# EAGLE design miniprotogrove (EAGLE 5.11)
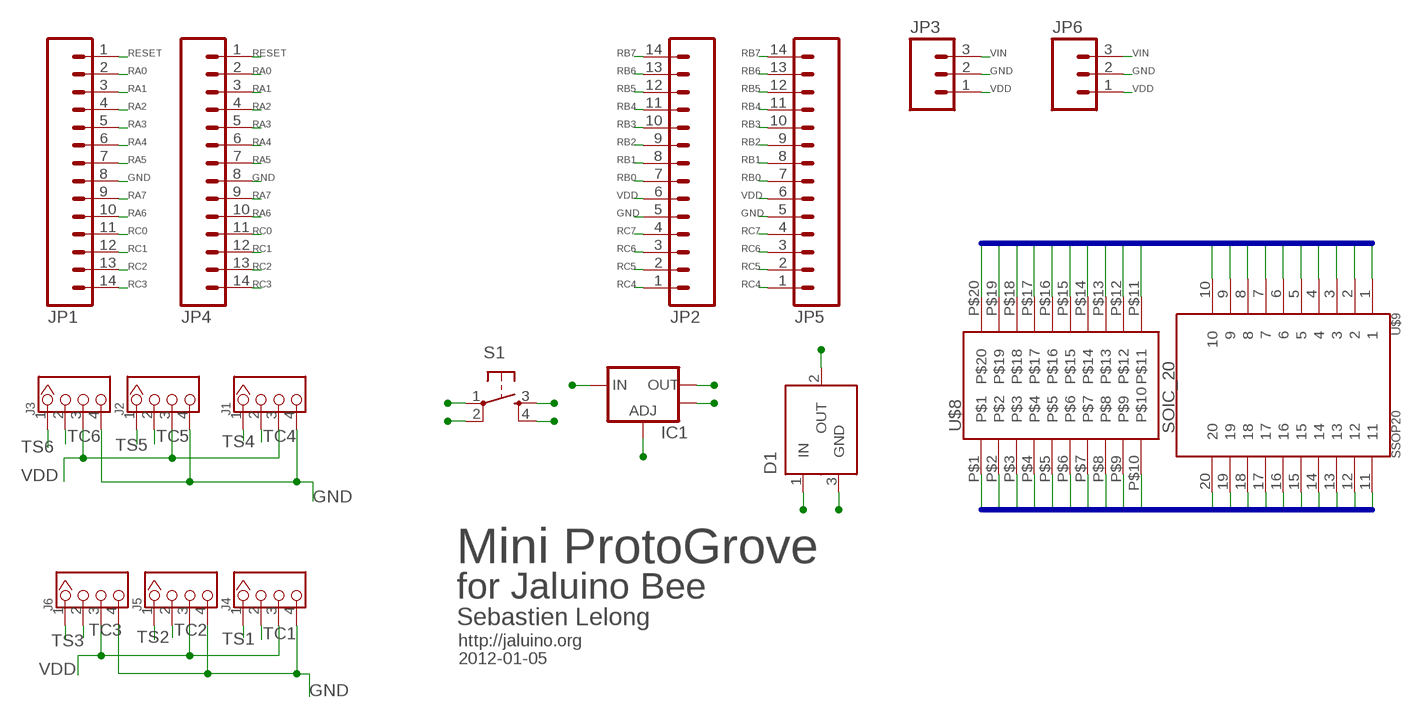
[diagram p0: schematic, sheet 1]

## Parts
D1  MAX6520  [SOT23]
IC1  V_REG_LM1117SOT223  [SOT223]
J1  TWIG-4P-2.0-2.0  [4P-2.0]
J2  TWIG-4P-2.0-2.0  [4P-2.0]
J3  TWIG-4P-2.0-2.0  [4P-2.0]
J4  TWIG-4P-2.0'90D'  [4P-2.0-90D]
J5  TWIG-4P-2.0'90D'  [4P-2.0-90D]
J6  TWIG-4P-2.0'90D'  [4P-2.0-90D]
JP1  M14  [1X14]
JP2  M14  [1X14]
JP3  M03PTH  [1X03]
JP4  M14  [1X14]
JP5  M14  [1X14]
JP6  M03PTH  [1X03]
S1  TAC_SWITCHSMD  [TACTILE_SWITCH_SMD]
U$8  SOIC_20  [SO20W]
U$9  SSOP20  [SSOP20-LONG]

## Nets
B1: U$8.P$11 U$9.10
B2: U$8.P$12 U$9.9
B3: U$8.P$13 U$9.8
B4: U$8.P$14 U$9.7
B5: U$8.P$15 U$9.6
B6: U$8.P$16 U$9.5
B7: U$8.P$17 U$9.4
B8: U$8.P$18 U$9.3
B9: U$8.P$19 U$9.2
B10: U$8.P$20 U$9.1
C1: U$8.P$1 U$9.20
C2: U$8.P$2 U$9.19
C3: U$8.P$3 U$9.18
C4: U$8.P$4 U$9.17
C5: U$8.P$5 U$9.16
C6: U$8.P$6 U$9.15
C7: U$8.P$7 U$9.14
C8: U$8.P$8 U$9.13
C9: U$8.P$9 U$9.12
C10: U$8.P$10 U$9.11
GND: J1.4 J2.4 J3.4 J4.4 J5.4 J6.4 JP1.8 JP2.5 JP3.2 JP4.8 JP5.5 JP6.2
N$188: IC1.3(IN)
N$191: IC1.1(ADJ)
N$192: IC1.2(OUT)
N$194: IC1.4(OUT)
N$197: D1.1(IN)
N$198: D1.3(GND)
N$199: D1.2(OUT)
N$200: S1.1
N$201: S1.2
N$202: S1.3
N$203: S1.4
RA0: JP1.2 JP4.2
RA1: JP1.3 JP4.3
RA2: JP1.4 JP4.4
RA3: JP1.5 JP4.5
RA4: JP1.6 JP4.6
RA5: JP1.7 JP4.7
RA6: JP1.10 JP4.10
RA7: JP1.9 JP4.9
RB0: JP2.7 JP5.7
RB1: JP2.8 JP5.8
RB2: JP2.9 JP5.9
RB3: JP2.10 JP5.10
RB4: JP2.11 JP5.11
RB5: JP2.12 JP5.12
RB6: JP2.13 JP5.13
RB7: JP2.14 JP5.14
RC0: JP1.11 JP4.11
RC1: JP1.12 JP4.12
RC2: JP1.13 JP4.13
RC3: JP1.14 JP4.14
RC4: JP2.1 JP5.1
RC5: JP2.2 JP5.2
RC6: JP2.3 JP5.3
RC7: JP2.4 JP5.4
RESET: JP1.1 JP4.1
TC1: J4.2
TC2: J5.2
TC3: J6.2
TC4: J1.2
TC5: J2.2
TC6: J3.2
TS1: J4.1
TS2: J5.1
TS3: J6.1
TS4: J1.1
TS5: J2.1
TS6: J3.1
VDD: J1.3 J2.3 J3.3 J4.3 J5.3 J6.3 JP2.6 JP3.1 JP5.6 JP6.1
VIN: JP3.3 JP6.3

## Buses
B[1..10]
C[1..10]

## Notes on the sheet
- Mini ProtoGrove
- for Jaluino Bee
- Sebastien Lelong
- http://jaluino.org
- 2012-01-05

## Library data of the parts
D1 = maxim:MAX6520: 1.2V Voltage Reference 50ppm/°C, SOT23, 3-Terminal Source: http://datasheets.maxim-ic.com/en/ds/MAX6520.pdf; MF: MAXIM; MPN: MAX6520EUR-T; OC_FARNELL: unknown; OC_NEWARK: 02J4586
IC1 = SparkFun:V_REG_LM1117: Voltage Regulator LM1117 Standard adjustable voltage regulator but in SMD form. Spark Fun Electronics SKU : COM-00595
J1-J6 = Connector:TWIG-4P-2.0
JP1 JP2 JP4 JP5 = SparkFun:M14: Header 14 Standard 14-pin 0.1" header. Use with straight break away headers (SKU : PRT-00116), right angle break away headers (PRT-00553), swiss pins (PRT-00743), machine pins (PRT-00117), and female headers (PRT-00115).
JP3 JP6 = SparkFun:M03: Header 3 Standard 3-pin 0.1" header. Use with straight break away headers (SKU : PRT-00116), right angle break away headers (PRT-00553), swiss pins (PRT-00743), machine pins (PRT-00117), and female headers (PRT-00115). Molex polarized connector foot print use with SKU : PRT-08232 with associated crimp pins and housings.
S1 = SparkFun:TAC_SWITCH: Momentary Switch Button commonly used for reset or general input. Spark Fun Electronics SKU : COM-00097
U$8 = SparkFun:SOIC_20
U$9 = SparkFun:SSOP20

## Board
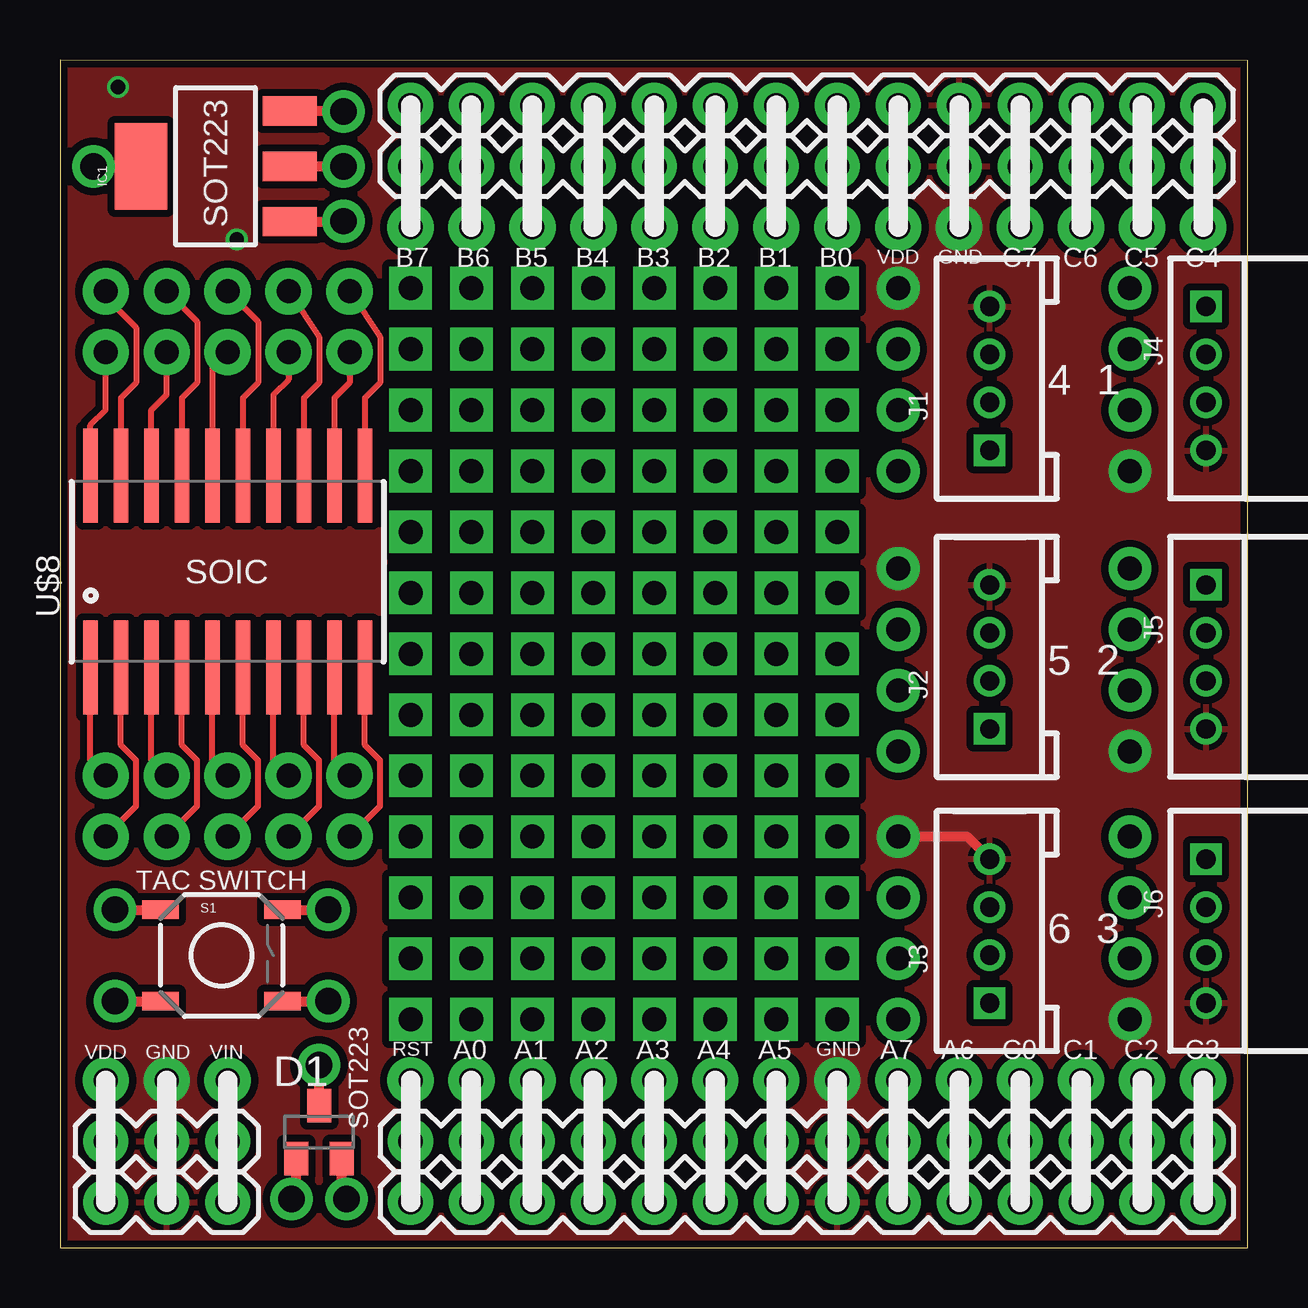
[diagram p1: board, top side]
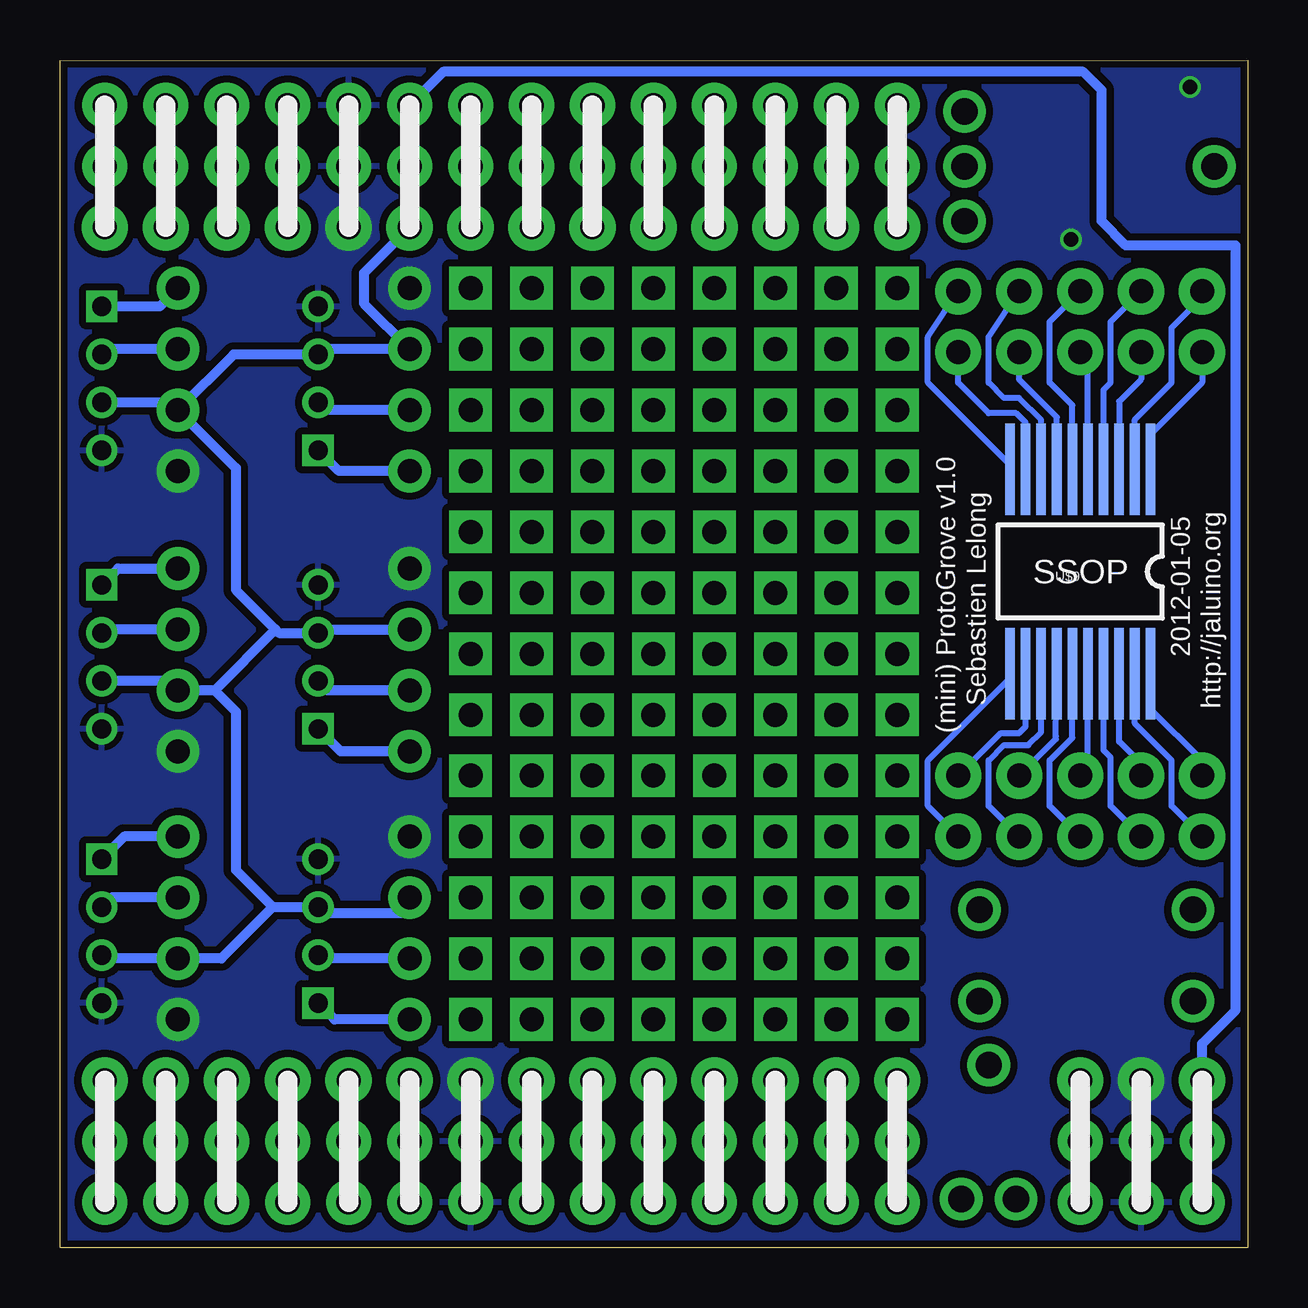
[diagram p2: board, bottom side, seen from below]

Size 49.49 x 49.52 mm. Coordinates in mm from the lower left corner, seen from the top.
Outline: 0,0 49.49,0 49.49,49.49 0,49.52 0,0
Copper layers (1*16): Top 0.035mm / dielectric 1.5mm / Bottom 0.035mm
Design rules "protogrove_seeed": minimum track width 6mil, minimum drill 12mil, track to track 6mil, track to pad 6mil, pad to pad 6mil, via to via 6mil, smd to smd 0mil, copper to edge 10mil, drill to drill 10mil, minimum pad ring 10mil, minimum via ring 6mil, stop-mask expansion 2mil, vias tented up to drill 100mil, thermal gap 10mil

### Footprints (pad centres in the part's own frame; a part is rotated, then mirrored left to right if it is on the bottom)
SOT23 = smd 1 x 1.4: 1 -0.95,-1.1; 2 0.95,-1.1; 3 0,1.1
SOT223 = smd 1.219 x 2.235: 1 -2.311,-3.099; 2 0,-3.099; 3 2.311,-3.099 | smd 3.6 x 2.2: 4 0,3.099
4P-2.0 = drill 0.8 pad 1.27 square: 1 -3,0 | drill 0.8 pad 1.27 round: 2 -1,0; 3 1,0; 4 3,0
4P-2.0-90D = drill 0.8 pad 1.27 square: 1 -3,0 | drill 0.8 pad 1.27 round: 2 -1,0; 3 1,0; 4 3,0
1X14 = drill 1.016 pad 1.88 round: 1 0,0; 2 2.54,0; 3 5.08,0; 4 7.62,0; 5 10.16,0; 6 12.7,0; 7 15.24,0; 8 17.78,0; 9 20.32,0; 10 22.86,0; 11 25.4,0; 12 27.94,0; 13 30.48,0; 14 33.02,0
1X03 = drill 1.016 pad 1.88 round: 1 0,0; 2 2.54,0; 3 5.08,0
TACTILE_SWITCH_SMD = smd 1.524 x 0.762: 1 -2.54,1.905; 2 2.54,1.905; 3 -2.54,-1.905; 4 2.54,-1.905
SO20W = smd 0.6 x 3.9: P$1 -5.715,-4; P$2 -4.445,-4; P$3 -3.175,-4; P$4 -1.905,-4; P$5 -0.635,-4; P$6 0.635,-4; P$7 1.905,-4; P$8 3.175,-4; P$9 4.445,-4; P$10 5.715,-4; P$11 5.715,4; P$12 4.445,4; P$13 3.175,4; P$14 1.905,4; P$15 0.635,4; P$16 -0.635,4; P$17 -1.905,4; P$18 -3.175,4; P$19 -4.445,4; P$20 -5.715,4
SSOP20-LONG = smd 0.4 x 3.81: 1 -2.925,-4.26; 2 -2.275,-4.26; 3 -1.625,-4.26; 4 -0.975,-4.26; 5 -0.325,-4.26; 6 0.325,-4.26; 7 0.975,-4.26; 8 1.625,-4.26; 9 2.275,-4.26; 10 2.925,-4.26; 11 2.925,4.26; 12 2.275,4.26; 13 1.625,4.26; 14 0.975,4.26; 15 0.325,4.26; 16 -0.325,4.26; 17 -0.975,4.26; 18 -1.625,4.26; 19 -2.275,4.26; 20 -2.925,4.26

### Placement (x,y rotation side)
D1  10.79,4.83 0 top
IC1  6.48,45.09 90 top
J1  38.73,36.25 90 top
J2  38.73,24.64 90 top
J3  38.73,13.21 90 top
J4  47.75,36.25 270 top
J5  47.75,24.64 270 top
J6  47.75,13.21 270 top
JP1  14.61,1.91 0 top
JP2  47.62,45.09 180 top
JP3  1.91,1.91 0 top
JP4  14.61,4.45 0 top
JP5  47.62,47.62 180 top
JP6  1.91,4.45 0 top
S1  6.73,12.19 0 top
U$8  6.99,28.19 0 top
U$9  6.99,28.19 180 bottom

### Tracks (layer width: path | path; a pad name or v marks a point on that pad's centre or on a via)
B1  (via drill 1 pad 1.93)
  Top 0.254: U$8.P$11 12.7,35.43 13.34,36.07 13.34,37.97 v12.06,39.88
  Bottom 0.254: U$9.10 9.91,32.64 13.34,36.07 13.34,37.97 v12.06,39.88
B2  (via drill 1 pad 1.93)
  Top 0.254: U$8.P$12 11.43,35.43 12.06,36.07 v12.06,37.34
  Bottom 0.254: U$9.9 9.26,34.41 9.65,34.8 10.79,34.8 12.06,36.07 v12.06,37.34
B3  (via drill 1 pad 1.93)
  Top 0.254: U$8.P$13 10.16,35.43 10.79,36.07 10.79,37.97 v9.53,39.88
  Bottom 0.254: U$9.8 8.61,34.52 9.53,35.43 10.16,35.43 10.79,36.07 10.79,37.97 v9.53,39.88
B4  (via drill 1 pad 1.93)
  Top 0.254: U$8.P$14 8.89,35.56 9.53,36.2 v9.53,37.34
  Bottom 0.254: U$9.7 7.96,34.63 9.53,36.2 v9.53,37.34
B5  (via drill 1 pad 1.93)
  Top 0.254: U$8.P$15 7.62,35.43 8.26,36.07 8.26,38.61 v6.99,39.88
  Bottom 0.254: U$9.6 7.31,35.12 8.26,36.07 8.26,38.61 v6.99,39.88
B6  (via drill 1 pad 1.93)
  Top 0.254: U$8.P$16 6.35,36.7 v6.99,37.34
  Bottom 0.254: U$9.5 6.66,37.01 v6.99,37.34
B7  (via drill 1 pad 1.93)
  Top 0.254: U$8.P$17 5.08,35.43 5.71,36.07 5.71,38.61 v4.45,39.88
  Bottom 0.254: U$9.4 6.01,35.77 5.71,36.07 5.71,38.61 v4.45,39.88
B8  (via drill 1 pad 1.93)
  Top 0.254: U$8.P$18 3.81,34.92 4.45,35.56 v4.45,37.34
  Bottom 0.254: U$9.3 5.36,35.28 4.45,36.2 v4.45,37.34
B9  (via drill 1 pad 1.93)
  Top 0.254: U$8.P$19 2.54,35.43 3.17,36.07 3.17,38.35 1.91,39.62 v1.91,39.88
  Bottom 0.254: U$9.2 4.71,34.53 3.17,36.07 3.17,38.35 1.91,39.62 v1.91,39.88
B10  (via drill 1 pad 1.93)
  Top 0.254: U$8.P$20 1.27,34.29 1.91,34.92 v1.91,37.34
  Bottom 0.254: U$9.1 4.06,33.91 1.91,36.07 v1.91,37.34
C1  (via drill 1 pad 1.93)
  Top 0.254: U$8.P$1 1.27,20.32 v1.91,19.68
  Bottom 0.254: U$9.20 4.06,22.48 1.91,20.32 v1.91,19.68
C2  (via drill 1 pad 1.93)
  Top 0.254: U$8.P$2 2.54,20.95 3.17,20.32 3.17,18.41 v1.91,17.14
  Bottom 0.254: U$9.19 4.71,21.86 3.17,20.32 3.17,18.41 v1.91,17.14
C3  (via drill 1 pad 1.93)
  Top 0.254: U$8.P$3 3.81,20.32 v4.45,19.68
  Bottom 0.254: U$9.18 5.36,21.11 4.45,20.19 v4.45,19.68
C4  (via drill 1 pad 1.93)
  Top 0.254: U$8.P$4 5.08,20.95 5.71,20.32 5.71,18.41 v4.45,17.14
  Bottom 0.254: U$9.17 6.01,20.74 5.71,20.45 5.71,18.41 v4.45,17.14
C5  (via drill 1 pad 1.93)
  Top 0.254: U$8.P$5 6.35,20.32 v6.99,19.68
  Bottom 0.254: U$9.16 6.66,20.01 v6.99,19.68
C6  (via drill 1 pad 1.93)
  Top 0.254: U$8.P$6 7.62,20.95 8.26,20.32 8.26,18.41 v6.99,17.14
  Bottom 0.254: U$9.15 7.31,21.27 8.26,20.32 8.26,18.41 v6.99,17.14
C7  (via drill 1 pad 1.93)
  Top 0.254: U$8.P$7 8.89,20.32 v9.53,19.68
  Bottom 0.254: U$9.14 8,21.34 8,21.21 v9.53,19.68
C8  (via drill 1 pad 1.93)
  Top 0.254: U$8.P$8 10.16,20.95 10.79,20.32 10.79,18.41 v9.53,17.14
  Bottom 0.254: U$9.13 8.61,21.49 9.14,20.95 10.16,20.95 10.79,20.32 10.79,18.41 v9.53,17.14
C9  (via drill 1 pad 1.93)
  Top 0.254: U$8.P$9 11.43,20.32 v12.06,19.68
  Bottom 0.254: U$9.12 9.26,21.73 9.53,21.46 10.29,21.46 v12.06,19.68
C10  (via drill 1 pad 1.93)
  Top 0.254: U$8.P$10 12.7,20.95 13.34,20.32 13.34,18.41 v12.06,17.14
  Bottom 0.254: U$9.11 9.91,23.75 13.34,20.32 13.34,18.41 v12.06,17.14
GND  (via drill 0.6, 1 pad 1.78, 1 pad 1.93)
  Top 0.406: JP2.5 JP5.5 | JP1.8 JP4.8 | JP3.2 JP6.2 | J3.4 37.8,17.14 v34.92,17.14
  other vias: 32.38,6.99 4.45,6.99 37.47,42.55 2.41,48.39 7.37,42.04 44.58,32.38 34.92,40.01 44.58,20.7 44.58,9.53 34.92,28.32
  pour Top (isolate 0.305): 0,49.53 49.53,49.53 49.53,0 0,0
  pour Bottom (isolate 0.305): 0,49.53 49.53,49.53 49.53,0 0,0
N$83  (via drill 1 pad 1.78)
  other vias: 32.38,9.53
N$84  (via drill 1 pad 1.78)
  other vias: 32.38,12.06
N$85  (via drill 1 pad 1.78)
  other vias: 32.38,14.61
N$86  (via drill 1 pad 1.78)
  other vias: 32.38,17.14
N$87  (via drill 1 pad 1.78)
  other vias: 32.38,19.68
N$88  (via drill 1 pad 1.78)
  other vias: 32.38,22.23
N$89  (via drill 1 pad 1.78)
  other vias: 32.38,24.77
N$90  (via drill 1 pad 1.78)
  other vias: 32.38,27.3
N$91  (via drill 1 pad 1.78)
  other vias: 32.38,29.84
N$92  (via drill 1 pad 1.78)
  other vias: 32.38,32.38
N$93  (via drill 1 pad 1.78)
  other vias: 32.38,34.92
N$94  (via drill 1 pad 1.78)
  other vias: 32.38,37.47
N$95  (via drill 1 pad 1.78)
  other vias: 32.38,40.01
N$96  (via drill 1 pad 1.78)
  other vias: 29.84,9.53
N$97  (via drill 1 pad 1.78)
  other vias: 29.84,12.06
N$98  (via drill 1 pad 1.78)
  other vias: 29.84,14.61
N$99  (via drill 1 pad 1.78)
  other vias: 29.84,17.14
N$100  (via drill 1 pad 1.78)
  other vias: 29.84,19.68
N$101  (via drill 1 pad 1.78)
  other vias: 29.84,22.23
N$102  (via drill 1 pad 1.78)
  other vias: 29.84,24.77
N$103  (via drill 1 pad 1.78)
  other vias: 29.84,27.3
N$104  (via drill 1 pad 1.78)
  other vias: 29.84,29.84
N$105  (via drill 1 pad 1.78)
  other vias: 29.84,32.38
N$106  (via drill 1 pad 1.78)
  other vias: 29.84,34.92
N$107  (via drill 1 pad 1.78)
  other vias: 29.84,37.47
N$108  (via drill 1 pad 1.78)
  other vias: 29.84,40.01
N$109  (via drill 1 pad 1.78)
  other vias: 27.3,9.53
N$110  (via drill 1 pad 1.78)
  other vias: 27.3,12.06
N$111  (via drill 1 pad 1.78)
  other vias: 27.3,14.61
N$112  (via drill 1 pad 1.78)
  other vias: 27.3,17.14
N$113  (via drill 1 pad 1.78)
  other vias: 27.3,19.68
N$114  (via drill 1 pad 1.78)
  other vias: 27.3,22.23
N$115  (via drill 1 pad 1.78)
  other vias: 27.3,24.77
N$116  (via drill 1 pad 1.78)
  other vias: 27.3,27.3
N$117  (via drill 1 pad 1.78)
  other vias: 27.3,29.84
N$118  (via drill 1 pad 1.78)
  other vias: 27.3,32.38
N$119  (via drill 1 pad 1.78)
  other vias: 27.3,34.92
N$120  (via drill 1 pad 1.78)
  other vias: 27.3,37.47
N$121  (via drill 1 pad 1.78)
  other vias: 27.3,40.01
N$122  (via drill 1 pad 1.78)
  other vias: 24.77,9.53
N$123  (via drill 1 pad 1.78)
  other vias: 24.77,12.06
N$124  (via drill 1 pad 1.78)
  other vias: 24.77,14.61
N$125  (via drill 1 pad 1.78)
  other vias: 24.77,17.14
N$126  (via drill 1 pad 1.78)
  other vias: 24.77,19.68
N$127  (via drill 1 pad 1.78)
  other vias: 24.77,22.23
N$128  (via drill 1 pad 1.78)
  other vias: 24.77,24.77
N$129  (via drill 1 pad 1.78)
  other vias: 24.77,27.3
N$130  (via drill 1 pad 1.78)
  other vias: 24.77,29.84
N$131  (via drill 1 pad 1.78)
  other vias: 24.77,32.38
N$132  (via drill 1 pad 1.78)
  other vias: 24.77,34.92
N$133  (via drill 1 pad 1.78)
  other vias: 24.77,37.47
N$134  (via drill 1 pad 1.78)
  other vias: 24.77,40.01
N$135  (via drill 1 pad 1.78)
  other vias: 22.23,9.53
N$136  (via drill 1 pad 1.78)
  other vias: 22.23,12.06
N$137  (via drill 1 pad 1.78)
  other vias: 22.23,14.61
N$138  (via drill 1 pad 1.78)
  other vias: 22.23,17.14
N$139  (via drill 1 pad 1.78)
  other vias: 22.23,19.68
N$140  (via drill 1 pad 1.78)
  other vias: 22.23,22.23
N$141  (via drill 1 pad 1.78)
  other vias: 22.23,24.77
N$142  (via drill 1 pad 1.78)
  other vias: 22.23,27.3
N$143  (via drill 1 pad 1.78)
  other vias: 22.23,29.84
N$144  (via drill 1 pad 1.78)
  other vias: 22.23,32.38
N$145  (via drill 1 pad 1.78)
  other vias: 22.23,34.92
N$146  (via drill 1 pad 1.78)
  other vias: 22.23,37.47
N$147  (via drill 1 pad 1.78)
  other vias: 22.23,40.01
N$148  (via drill 1 pad 1.78)
  other vias: 19.68,9.53
N$149  (via drill 1 pad 1.78)
  other vias: 19.68,12.06
N$150  (via drill 1 pad 1.78)
  other vias: 19.68,14.61
N$151  (via drill 1 pad 1.78)
  other vias: 19.68,17.14
N$152  (via drill 1 pad 1.78)
  other vias: 19.68,19.68
N$153  (via drill 1 pad 1.78)
  other vias: 19.68,22.23
N$154  (via drill 1 pad 1.78)
  other vias: 19.68,24.77
N$155  (via drill 1 pad 1.78)
  other vias: 19.68,27.3
N$156  (via drill 1 pad 1.78)
  other vias: 19.68,29.84
N$157  (via drill 1 pad 1.78)
  other vias: 19.68,32.38
N$158  (via drill 1 pad 1.78)
  other vias: 19.68,34.92
N$159  (via drill 1 pad 1.78)
  other vias: 19.68,37.47
N$160  (via drill 1 pad 1.78)
  other vias: 19.68,40.01
N$161  (via drill 1 pad 1.78)
  other vias: 17.14,9.53
N$162  (via drill 1 pad 1.78)
  other vias: 17.14,12.06
N$163  (via drill 1 pad 1.78)
  other vias: 17.14,14.61
N$164  (via drill 1 pad 1.78)
  other vias: 17.14,17.14
N$165  (via drill 1 pad 1.78)
  other vias: 17.14,19.68
N$166  (via drill 1 pad 1.78)
  other vias: 17.14,22.23
N$167  (via drill 1 pad 1.78)
  other vias: 17.14,24.77
N$168  (via drill 1 pad 1.78)
  other vias: 17.14,27.3
N$169  (via drill 1 pad 1.78)
  other vias: 17.14,29.84
N$170  (via drill 1 pad 1.78)
  other vias: 17.14,32.38
N$171  (via drill 1 pad 1.78)
  other vias: 17.14,34.92
N$172  (via drill 1 pad 1.78)
  other vias: 17.14,37.47
N$173  (via drill 1 pad 1.78)
  other vias: 17.14,40.01
N$174  (via drill 1 pad 1.78)
  other vias: 14.61,9.53
N$175  (via drill 1 pad 1.78)
  other vias: 14.61,12.06
N$176  (via drill 1 pad 1.78)
  other vias: 14.61,14.61
N$177  (via drill 1 pad 1.78)
  other vias: 14.61,17.14
N$178  (via drill 1 pad 1.78)
  other vias: 14.61,19.68
N$179  (via drill 1 pad 1.78)
  other vias: 14.61,22.23
N$180  (via drill 1 pad 1.78)
  other vias: 14.61,24.77
N$181  (via drill 1 pad 1.78)
  other vias: 14.61,27.3
N$182  (via drill 1 pad 1.78)
  other vias: 14.61,29.84
N$183  (via drill 1 pad 1.78)
  other vias: 14.61,32.38
N$184  (via drill 1 pad 1.78)
  other vias: 14.61,34.92
N$185  (via drill 1 pad 1.78)
  other vias: 14.61,37.47
N$186  (via drill 1 pad 1.78)
  other vias: 14.61,40.01
N$188  (via drill 1.1 pad 1.78)
  Top 0.406: IC1.3 11.79,47.4 v11.81,47.37
N$191  (via drill 1.1 pad 1.78)
  Top 0.406: IC1.1 11.79,42.77 v11.81,42.8
N$192  (via drill 1.1 pad 1.78)
  Top 0.406: IC1.2 v11.81,45.09
N$194  (via drill 1.1 pad 1.78)
  Top 0.406: v1.4,45.09 IC1.4
N$197  (via drill 1.1 pad 1.78)
  Top 0.406: D1.1 9.85,2.23 v9.65,2.03
N$198  (via drill 1.1 pad 1.78)
  Top 0.406: D1.3 v10.79,7.62
N$199  (via drill 1.1 pad 1.78)
  Top 0.406: D1.2 11.74,2.23 v11.94,2.03
N$200  (via drill 1.1 pad 1.78)
  Top 0.406: v2.29,14.1 S1.1
N$201  (via drill 1.1 pad 1.78)
  Top 0.406: S1.2 v11.18,14.1
N$202  (via drill 1.1 pad 1.78)
  Top 0.406: v2.29,10.29 S1.3
N$203  (via drill 1.1 pad 1.78)
  Top 0.406: S1.4 v11.18,10.29
RA0  (via drill 1 pad 1.93)
  Top 0.406: JP1.2 JP4.2 v17.14,6.99
RA1  (via drill 1 pad 1.93)
  Top 0.406: JP1.3 JP4.3 v19.68,6.99
RA2  (via drill 1 pad 1.93)
  Top 0.406: JP1.4 JP4.4 v22.23,6.99
RA3  (via drill 1 pad 1.93)
  Top 0.406: JP1.5 JP4.5 v24.77,6.99
RA4  (via drill 1 pad 1.93)
  Top 0.406: JP1.6 JP4.6 v27.3,6.99
RA5  (via drill 1 pad 1.93)
  Top 0.406: JP1.7 JP4.7 v29.84,6.99
RA6  (via drill 1 pad 1.93)
  Top 0.406: JP1.10 JP4.10 v37.47,6.99
RA7  (via drill 1 pad 1.93)
  Top 0.406: JP1.9 JP4.9 v34.92,6.99
RB0  (via drill 1 pad 1.93)
  Top 0.406: JP5.7 JP2.7 v32.38,42.55
RB1  (via drill 1 pad 1.93)
  Top 0.406: JP5.8 JP2.8 v29.84,42.55
RB2  (via drill 1 pad 1.93)
  Top 0.406: JP5.9 JP2.9 v27.3,42.55
RB3  (via drill 1 pad 1.93)
  Top 0.406: JP5.10 JP2.10 v24.77,42.55
RB4  (via drill 1 pad 1.93)
  Top 0.406: JP5.11 JP2.11 v22.23,42.55
RB5  (via drill 1 pad 1.93)
  Top 0.406: JP5.12 JP2.12 v19.68,42.55
RB6  (via drill 1 pad 1.93)
  Top 0.406: JP5.13 JP2.13 v17.14,42.55
RB7  (via drill 1 pad 1.93)
  Top 0.406: JP5.14 JP2.14 v14.61,42.55
RC0  (via drill 1 pad 1.93)
  Top 0.406: JP1.11 JP4.11 v40.01,6.99
RC1  (via drill 1 pad 1.93)
  Top 0.406: JP1.12 JP4.12 v42.55,6.99
RC2  (via drill 1 pad 1.93)
  Top 0.406: JP1.13 JP4.13 v45.09,6.99
RC3  (via drill 1 pad 1.93)
  Top 0.406: JP1.14 JP4.14 v47.62,6.99
RC4  (via drill 1 pad 1.93)
  Top 0.406: JP5.1 JP2.1 v47.62,42.55
RC5  (via drill 1 pad 1.93)
  Top 0.406: JP5.2 JP2.2 v45.09,42.55
RC6  (via drill 1 pad 1.93)
  Top 0.406: JP5.3 JP2.3 v42.55,42.55
RC7  (via drill 1 pad 1.93)
  Top 0.406: JP5.4 JP2.4 v40.01,42.55
RESET  (via drill 1 pad 1.93)
  Top 0.406: JP1.1 JP4.1 v14.61,6.99
TC1  (via drill 1 pad 1.78)
  Bottom 0.406: v44.58,37.47 47.53,37.47 J4.2
TC2  (via drill 1 pad 1.78)
  Bottom 0.406: v44.58,25.78 47.61,25.78 J5.2
TC3  (via drill 1 pad 1.78)
  Bottom 0.406: v44.58,14.61 47.35,14.61 J6.2
TC4  (via drill 1 pad 1.78)
  Bottom 0.406: v34.92,34.92 38.41,34.92 J1.2
TC5  (via drill 1 pad 1.78)
  Bottom 0.406: v34.92,23.24 38.34,23.24 J2.2
TC6  (via drill 1 pad 1.78)
  Bottom 0.406: v34.92,12.06 38.59,12.06 J3.2
TS1  (via drill 1 pad 1.78)
  Bottom 0.406: J4.1 45.34,39.25 v44.58,40.01
TS2  (via drill 1 pad 1.78)
  Bottom 0.406: J5.1 47.07,28.32 v44.58,28.32
TS3  (via drill 1 pad 1.78)
  Bottom 0.406: J6.1 46.81,17.14 v44.58,17.14
TS4  (via drill 1 pad 1.78)
  Bottom 0.406: J1.1 37.87,32.38 v34.92,32.38
TS5  (via drill 1 pad 1.78)
  Bottom 0.406: J2.1 37.8,20.7 v34.92,20.7
TS6  (via drill 1 pad 1.78)
  Bottom 0.406: J3.1 38.05,9.53 v34.92,9.53
VDD  (via drill 1 pad 1.78, 1 pad 1.93)
  Top 0.406: JP5.6 JP2.6 v34.92,42.55 | JP3.1 JP6.1 v1.91,6.99
  Bottom 0.406: v1.91,6.99 1.91,8.51 0.51,9.91 0.51,41.78 5.08,41.78 6.1,42.8 6.1,48.26 6.86,49.02 33.53,49.02 JP5.6 | J4.3 44.9,35.25 v44.58,34.92 | v44.58,34.92 42.26,37.25 J1.3 38.52,37.47 v34.92,37.47 36.83,39.37 36.83,40.64 v34.92,42.55 | v44.58,34.92 42.16,32.51 42.16,27.43 40.51,25.78 | 40.51,25.78 40.37,25.64 J2.3 38.59,25.78 v34.92,25.78 | J5.3 44.97,23.64 v44.58,23.24 43.05,23.24 | 40.51,25.78 43.05,23.24 | 43.05,23.24 42.16,22.35 42.16,15.75 40.62,14.21 | 40.62,14.21 J3.3 38.5,13.97 35.05,13.97 34.92,14.1 v34.92,14.61 | 40.62,14.21 42.77,12.06 v44.58,12.06 47.61,12.06 J6.3
VIN  (via drill 1 pad 1.93)
  Top 0.406: JP3.3 JP6.3 v6.99,6.99

### Text on the board
tNames: 4 | 1 | 5 | 2 | 6 | 3
_tsilk: SOT223 | B7 | B6 | B5 | B4 | B3 | B2 | B1 | B0 | VDD | GND | C7 | C6 | C5 | C4 | SOIC | TAC SWITCH | VDD | GND | VIN | RST | A0 | A1 | A2 | A3 | A4 | A5 | GND | A7 | A6 | C0 | C1 | C2 | C3 | SOT223
_bsilk: SSOP | 2012-01-05 | Sebastien Lelong | http://jaluino.org | (mini) ProtoGrove v1.0